# Altium project MultiSpikeHold.PrjPcb
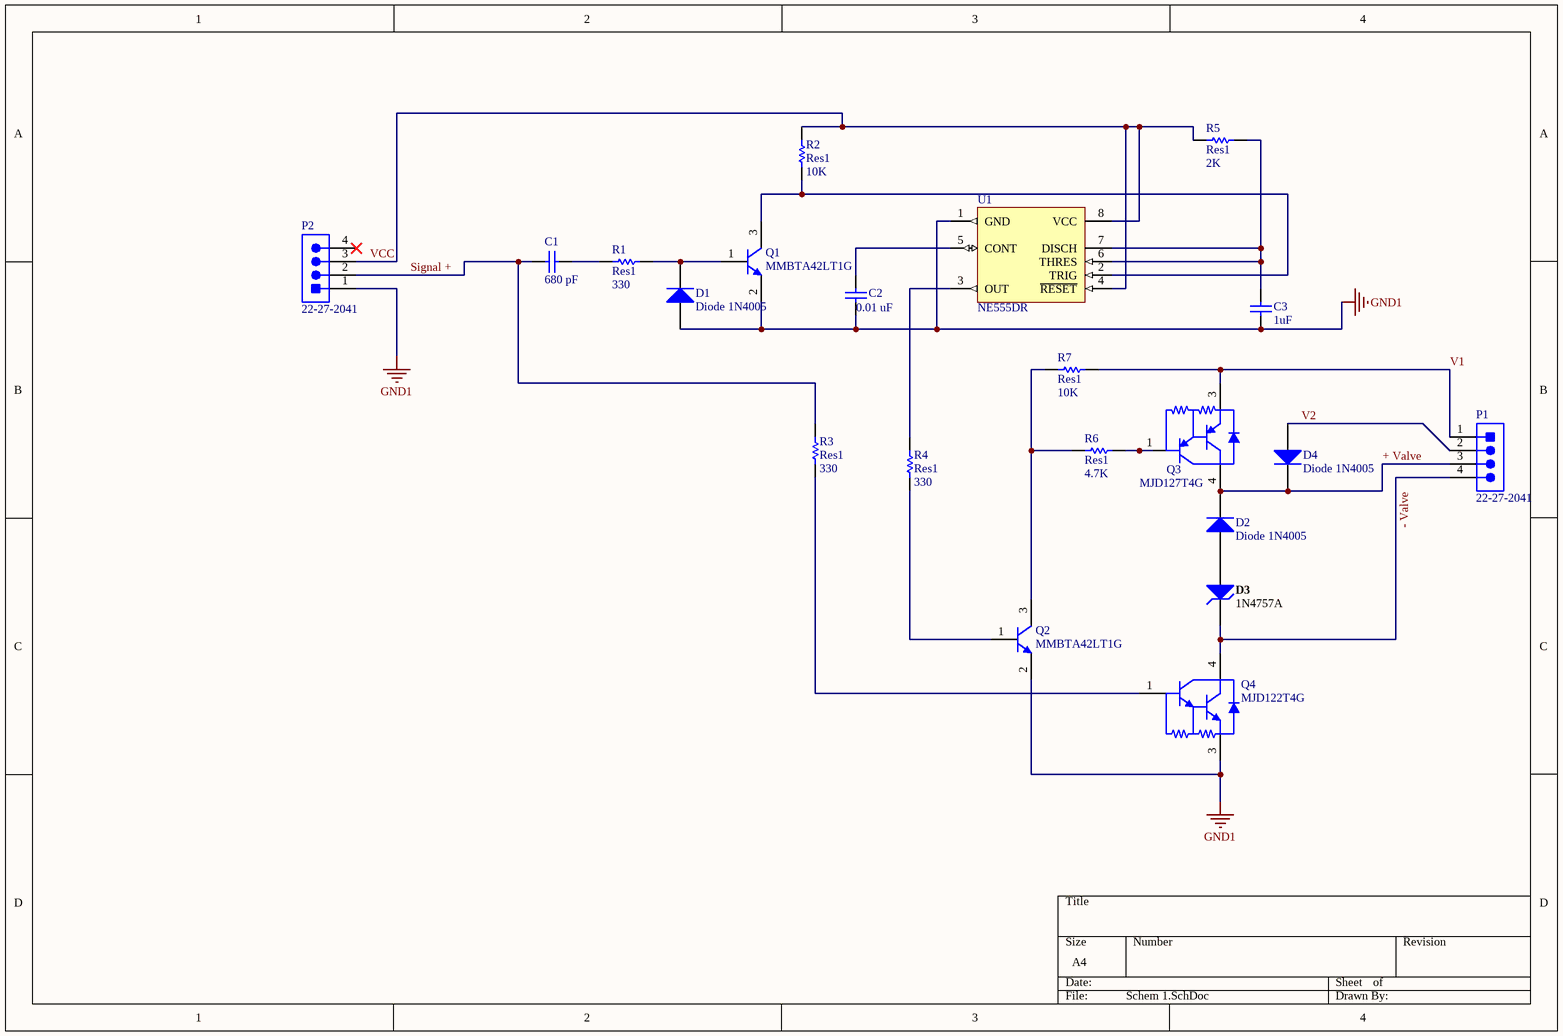
[diagram p0: Schem 1.SchDoc]
2 sheets, 139 parts. Net scope: global (net labels, ports and power ports of the same name join across sheets).
Sheets:
  Schem 1.SchDoc
  MultiSpikeHoldSchem.SchDoc

## Sheet Schem 1.SchDoc
size A4

### Parts
(Parts that share a designator on the sheet are numbered #1, #2 ... from top to bottom, then left to right.)
C1#1  680 pF  [CAPC1005X55X30LL05T10]
C2#1  0.01 uF  [CAPC1608X87X35LL15T15]
C3#1  1uF  [CAPC1206(3216)110_L]
D1#1  Diode 1N4005  [DO-41]
D2#1  Diode 1N4005  [DO-41]
D3#1  1N4757A  [FAIR-DO-41-2_V]
D4#1  Diode 1N4005  [DO-41]
P1#1  22-27-2041  [MOLX-22-27-2041_V]
P2#1  22-27-2041  [MOLX-22-27-2041_V]
Q1#1  MMBTA42LT1G  [ONSC-SOT-23-3-318-08_V]
Q2#1  MMBTA42LT1G  [ONSC-SOT-23-3-318-08_V]
Q3#1  MJD127T4G  [ONSC-DPAK-3-369C-01_V]
Q4#1  MJD122T4G  [ONSC-DPAK-3-369C-01_V]
R1#1  Res1  value 330  [AXIAL-0.3]
R2#1  Res1  value 10K  [AXIAL-0.3]
R3#1  Res1  value 330  [AXIAL-0.3]
R4#1  Res1  value 330  [AXIAL-0.3]
R5#1  Res1  value 2K  [AXIAL-0.3]
R6#1  Res1  value 4.7K  [AXIAL-0.3]
R7#1  Res1  value 10K  [AXIAL-0.3]
U1#1  NE555DR  [D0008A_L]

### Nets
GND1: C2#1.1 C3#1.1 D1#1.1(A) P2#1.1 Q1#1.2(E) Q2#1.2(E) Q4#1.3(E) U1#1.1(GND)
+ Valve: D2#1.2(K) D4#1.2(K) P1#1.3 Q3#1.4(C)
- Valve: D3#1.2(K) P1#1.4 Q4#1.4(C)
Signal +: C1#1.1 P2#1.2 R3#1.2
V1: P1#1.1 Q3#1.3(E) R7#1.2
V2: D4#1.1(A) P1#1.2
VCC: P2#1.3 R2#1.2 R5#1.1 U1#1.4(~{RESET}) U1#1.8(VCC)
NetC1#1_2: C1#1.2 R1#1.1
NetC2#1_2: C2#1.2 U1#1.5(CONT)
NetC3#1_2: C3#1.2 R5#1.2 U1#1.6(THRES) U1#1.7(DISCH)
NetD1#1_2: D1#1.2(K) Q1#1.1(B) R1#1.2
NetD2#1_1: D2#1.1(A) D3#1.1(A)
NetQ1#1_3: Q1#1.3(C) R2#1.1 U1#1.2(TRIG)
NetQ2#1_1: Q2#1.1(B) R4#1.1
NetQ2#1_3: Q2#1.3(C) R6#1.1 R7#1.1
NetQ3#1_1: Q3#1.1(B) R6#1.2
NetQ4#1_1: Q4#1.1(B) R3#1.1
NetR4#1_2: R4#1.2 U1#1.3(OUT)

Not connected (* = marked no-connect by the designer): P2#1 4*

### Library data of the parts
C1#1 = CMP-2008-03245-1: Part Number: C0402C681K5RACTU; Manufacturer: Kemet
C2#1 = CMP-2006-03044-1: Part Number: C0603C103K5RACTU; Manufacturer: Kemet
C3#1 = CMP-1037-04718-1: CAP 1uF 50V ±10% 1206 (3216 Metric) Thickness 1.1mm SMD; Tolerance: Â±10%; Case-EIA: 1206; Case-Metric: 3216; Rated Voltage: 50 V; Max Thickness: 1.1 mm; Value: 1uF; Technology: SMT
D1#1 D2#1 D4#1 = Diode 1N4005: 1 Amp General Purpose Rectifier; Published: 8-Jun-2000; LatestRevisionDate: 17-Jul-2002; LatestRevisionNote: Re-released for DXP Platform.; DatasheetVersion: 1998; PackageVersion: Aug-1999; PackageReference: DO-41; Publisher: Altium Limited; PackageDescription: Diode, Axial; Body 5.2 x 2.7 mm (LxDia. max), Lead Dia. 0.86 mm (max); Code_JEDEC: DO-204-AL; ComponentLink1Description: Manufacturer Link; ComponentLink1URL: http://www.fairchildsemi.com/; ComponentLink2Description: Datasheet; ComponentLink2URL: http://www.fairchildsemi.com/ds/1N%2F1N4001.pdf
D3#1 = CMP-0892-00018-1: Zener Diode, 51V, 1W, 5%, -65 to 200 degC, 2-Pin DO-41, Body 2.72 x 5.2 mm, RoHS; Manufacturer: Fairchild Semiconductor; Test Current IZ (mA): 5; ZZ (Max) (ohm): 95; VZ (Min.) (V): 48.45; VZ (Max.) (V): 53.55; PD (W): 1; Mounting Technology: Through Hole; ComponentLink2Description: Datasheet; ComponentLink1Description: Manufacturer URL; ComponentLink2URL: http://www.fairchildsemi.com/ds/1N/1N4744A.pdf; PackageReference: DO-41-2; PartNumber: 1N4757A; Tolerance: 5%; ComponentLink3URL: http://www.fairchildsemi.com/dwg/DO/DO41A.pdf; IR (uA): 5; PackageDescription: 2-Pin Axial leaded, Body 2.72 x 5.2 mm, Lead Spread 25.4 mm; ComponentLink3Description: Package Specification; RoHS: TRUE; DatasheetVersion: Rev. H3; ComponentLink1URL: http://www.fairchildsemi.com/; PackageVersion: Rev. 2; Operating and Storage Temperature Range: -65 to 200 degC
P1#1 P2#1 = CMP-2000-05243-1: Male Header, Pitch 2.54 mm, 1 x 4 Position, Height 11.7 mm, Tail Length 3.56 mm, RoHS, Bulk; Manufacturer: Molex; Voltage rating: 250V; Current rating: 4A; Datasheet Version: Rev. F, 06/2009; Operating temperature: 0degCto+75degC; Contact material: Tinplatedbrass; Manufacturer URL: http://www.molex.com/; Housing material: Nylon(UL94V-0); Datasheet URL: http://www.molex.com/pdm_docs/sd/022272041_sd.pdf
Q1#1 Q2#1 = CMP-1048-00662-1: High Voltage Transistor, NPN Silicon, 3-Pin SOT-23, Pb-Free, Tape and Reel; Manufacturer: On Semiconductor; fT Min (MHz): 50; IC Continuous (A): 0.5; ComponentLink1URL: http://www.onsemi.com/; ComponentLink3URL: http://www.onsemi.cn/pub_link/Collateral/318-08.PDF; RoHS: TRUE; ComponentLink2Description: Datasheet; PartNumber: MMBTA42LT1G; Polarity: NPN; DatasheetVersion: Rev. 12; PackageReference: SOT-23-3-318-08; PackageDescription: 3-Pin Small Outline Transistor, Body 2.92 x 1.3 mm, Pitch 0.95 mm; ComponentLink3Description: Package Specification; ComponentLink1Description: Manufacturer URL; Packing: Tape and Reel; PackageVersion: Rev. AP, 11/2009; Mounting Technology: Surface Mount; ComponentLink2URL: http://www.onsemi.cn/pub_link/Collateral/MMBTA42LT1-D.PDF
Q3#1 = CMP-1047-00009-1: Complementary Darlington Power Transistor, 3-Pin DPAK, Pb-Free, Tape and Reel; Manufacturer: On Semiconductor; Polarity: PNP; IC Continuous (A): 8; hFE Max (k): 12; ComponentLink3URL: http://www.onsemi.cn/pub_link/Collateral/369C.PDF; PackageReference: DPAK-3-369C-01; RoHS: TRUE; PartNumber: MJD127T4G; ComponentLink2URL: http://www.onsemi.com/pub_link/Collateral/MJD122-D.PDF; PackageDescription: 3-Pin Flange Mount, Body 6.54 x 6.095 mm, Pitch 2.29 mm; Mounting Technology: Surface Mount; Packing: Tape and Reel; DatasheetVersion: Rev. 13; ComponentLink2Description: Datasheet; ComponentLink3Description: Package Specification; ComponentLink1URL: http://www.onsemi.com/; ComponentLink1Description: Manufacturer URL; PackageVersion: Rev. E, 02/2014
Q4#1 = CMP-1047-00007-1: Complementary Darlington Power Transistor, 3-Pin DPAK, Pb-Free, Tape and Reel; Manufacturer: On Semiconductor; IC Continuous (A): 8; hFE Max (k): 12; Polarity: NPN; ComponentLink1Description: Manufacturer URL; ComponentLink3URL: http://www.onsemi.cn/pub_link/Collateral/369C.PDF; Mounting Technology: Surface Mount; RoHS: TRUE; ComponentLink2Description: Datasheet; ComponentLink1URL: http://www.onsemi.com/; ComponentLink3Description: Package Specification; DatasheetVersion: Rev. 13; PackageDescription: 3-Pin Flange Mount, Body 6.54 x 6.095 mm, Pitch 2.29 mm; PartNumber: MJD122T4G; ComponentLink2URL: http://www.onsemi.com/pub_link/Collateral/MJD122-D.PDF; PackageVersion: Rev. E, 02/2014; PackageReference: DPAK-3-369C-01; Packing: Tape and Reel
R1#1 R2#1 R3#1 R4#1 R5#1 R6#1 R7#1 = Res1: Resistor; Published: 8-Jun-2000; LatestRevisionDate: 17-Jul-2002; LatestRevisionNote: Re-released for DXP Platform.; PackageReference: AXIAL-0.3; Publisher: Altium Limited; PackageDescription: Axial Device, Thru-Hole; 2 Leads; 0.3 in Pin Spacing
U1#1 = CMP-1685-00007-1: Precision Timer, 4.5 to 16 V, 0 to 70 degC, 8-Pin SOIC (D8), Green (RoHS & no Sb/Br), Tape and Reel; Forward Voltage: 450 mV; Forward Current: 1 A; Max Surge Current: 30 A; Peak Reverse Current: 500 uA; Case\Package: SMA; PackageReference: D0008A; Width: 2.84 mm; PackageDescription: 8-Pin Small Outline Integrated Circuit, Body 4.9 x 3.9 mm, Pitch 1.27 mm; DatasheetVersion: SLFS022I, 09/2014; ComponentLink2Description: Datasheet; Package Quantity: 1; REACH SVHC: Unknown; Radiation Hardening: No; Height: 2.44 mm; Code_JEDEC: MS-012; Pins: 2; ComponentLink1Description: Manufacturer URL; ComponentLink3Description: Package Specification; ComponentLink3URL: http://www.ti.com/lit/ml/msoi002j/msoi002j.pdf; Length: 4.57 mm; ComponentLink1URL: http://www.ti.com/; Mount: Surface Mount; PackageVersion: 4040047-3/M, 06/2011; ComponentLink2URL: http://www.ti.com/general/docs/lit/getliterature.tsp?genericPartNumber=NE555&fileType=pdf; RoHSCompliant: true; Max Operating Temperature: 125 degC; Packaging: Cut Tape; Min Operating Temperature: -55 degC

## Sheet MultiSpikeHoldSchem.SchDoc
size A1
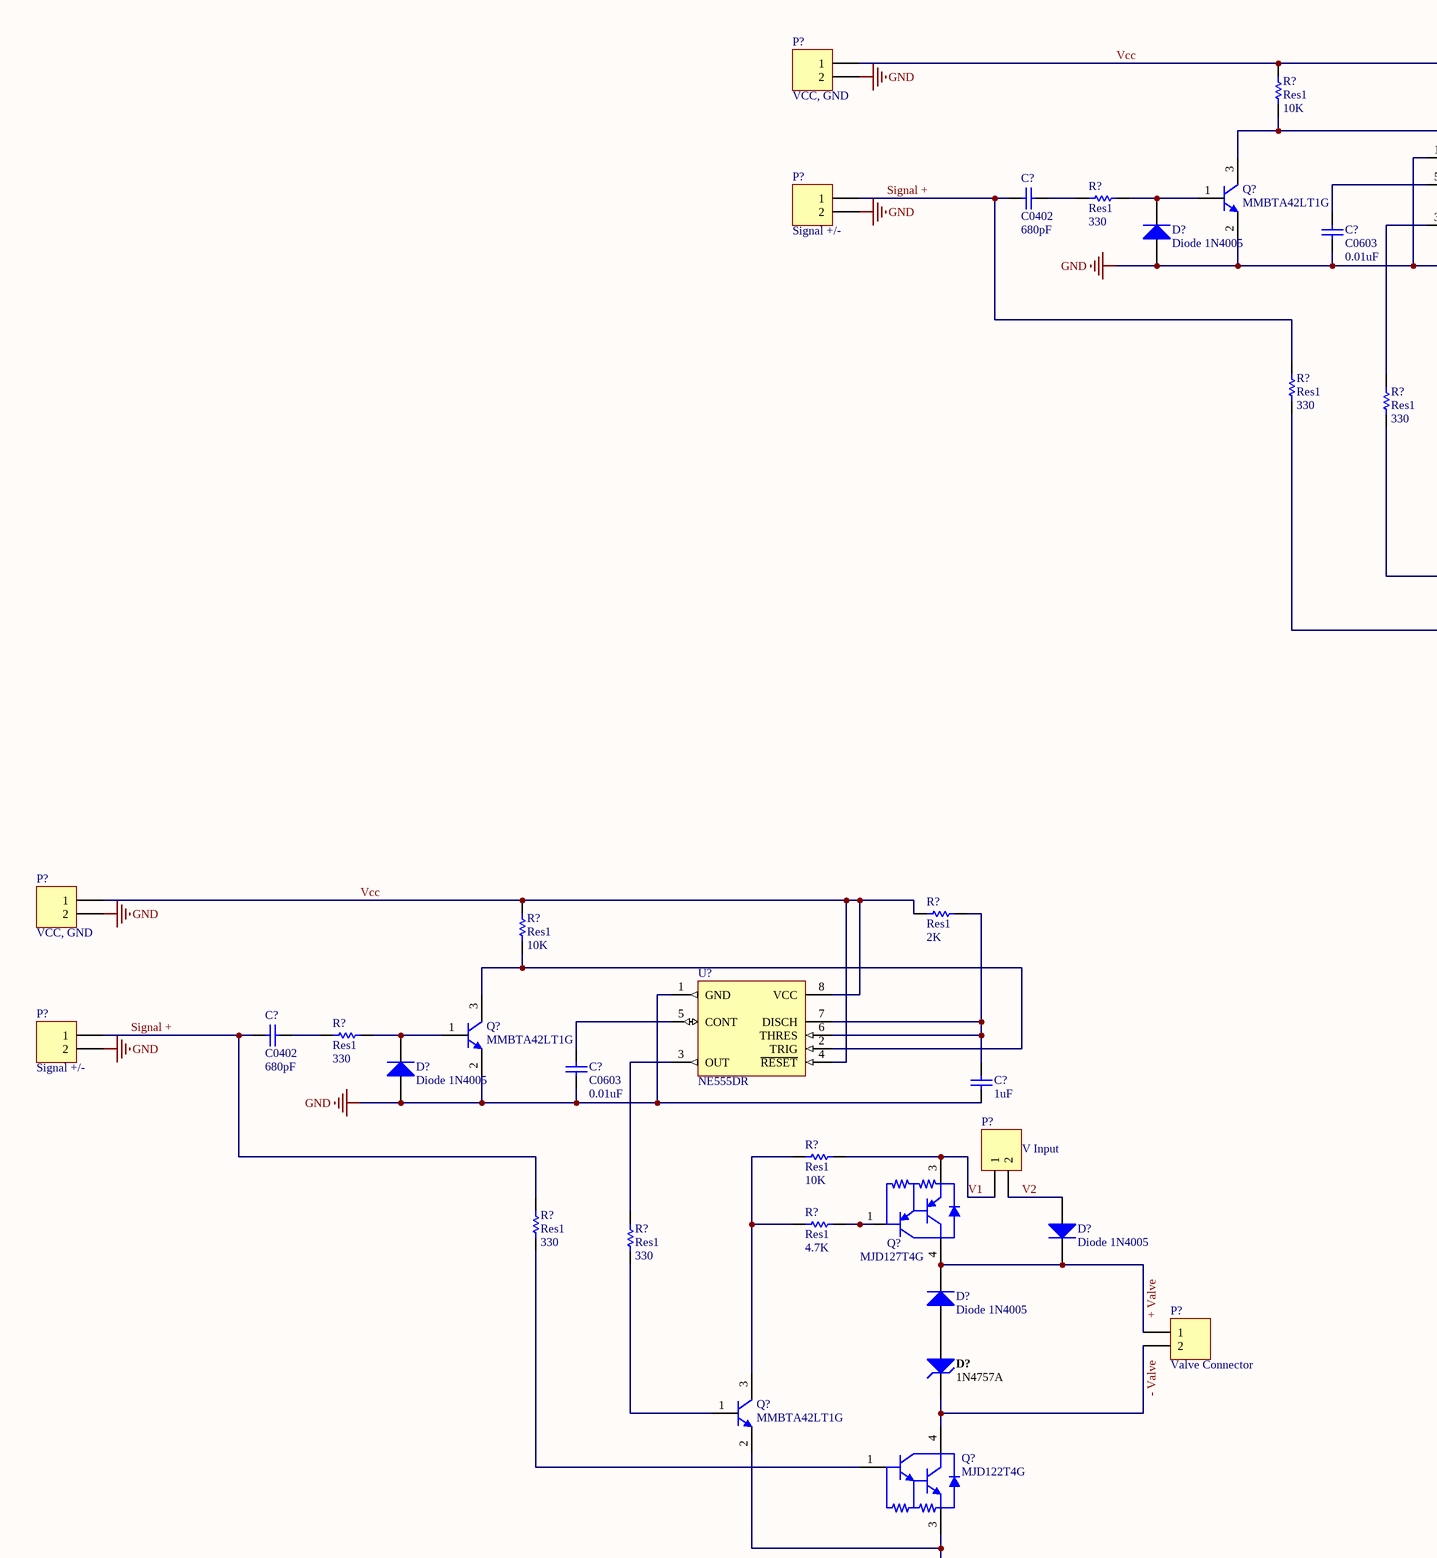
[diagram p1: MultiSpikeHoldSchem.SchDoc, top left]
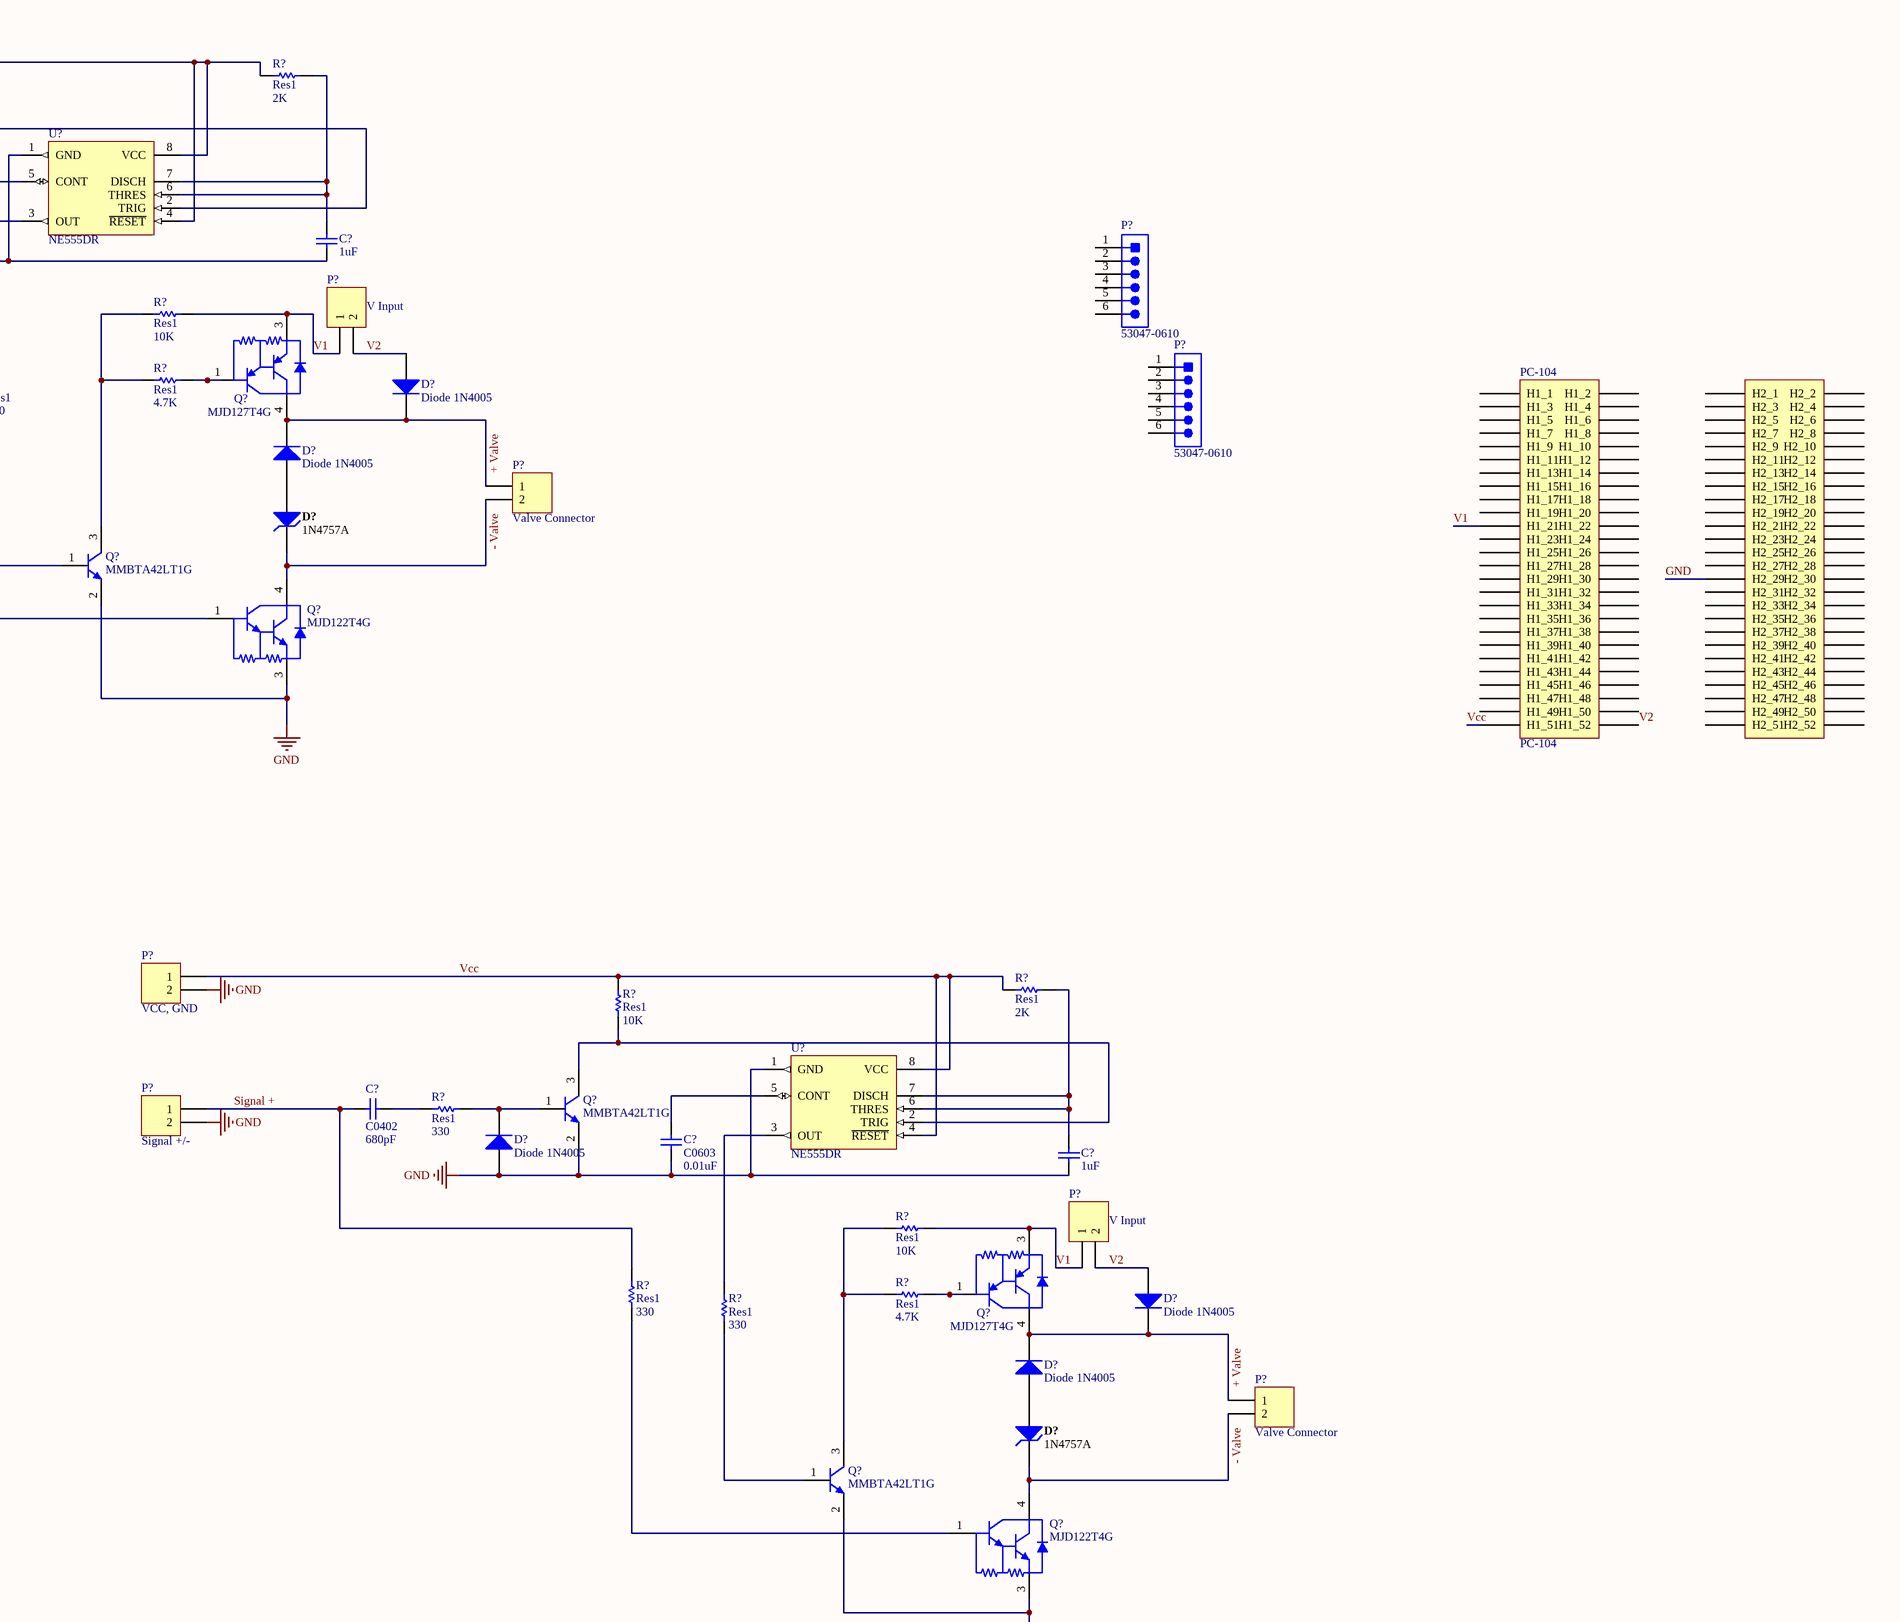
[diagram p2: MultiSpikeHoldSchem.SchDoc, top right]
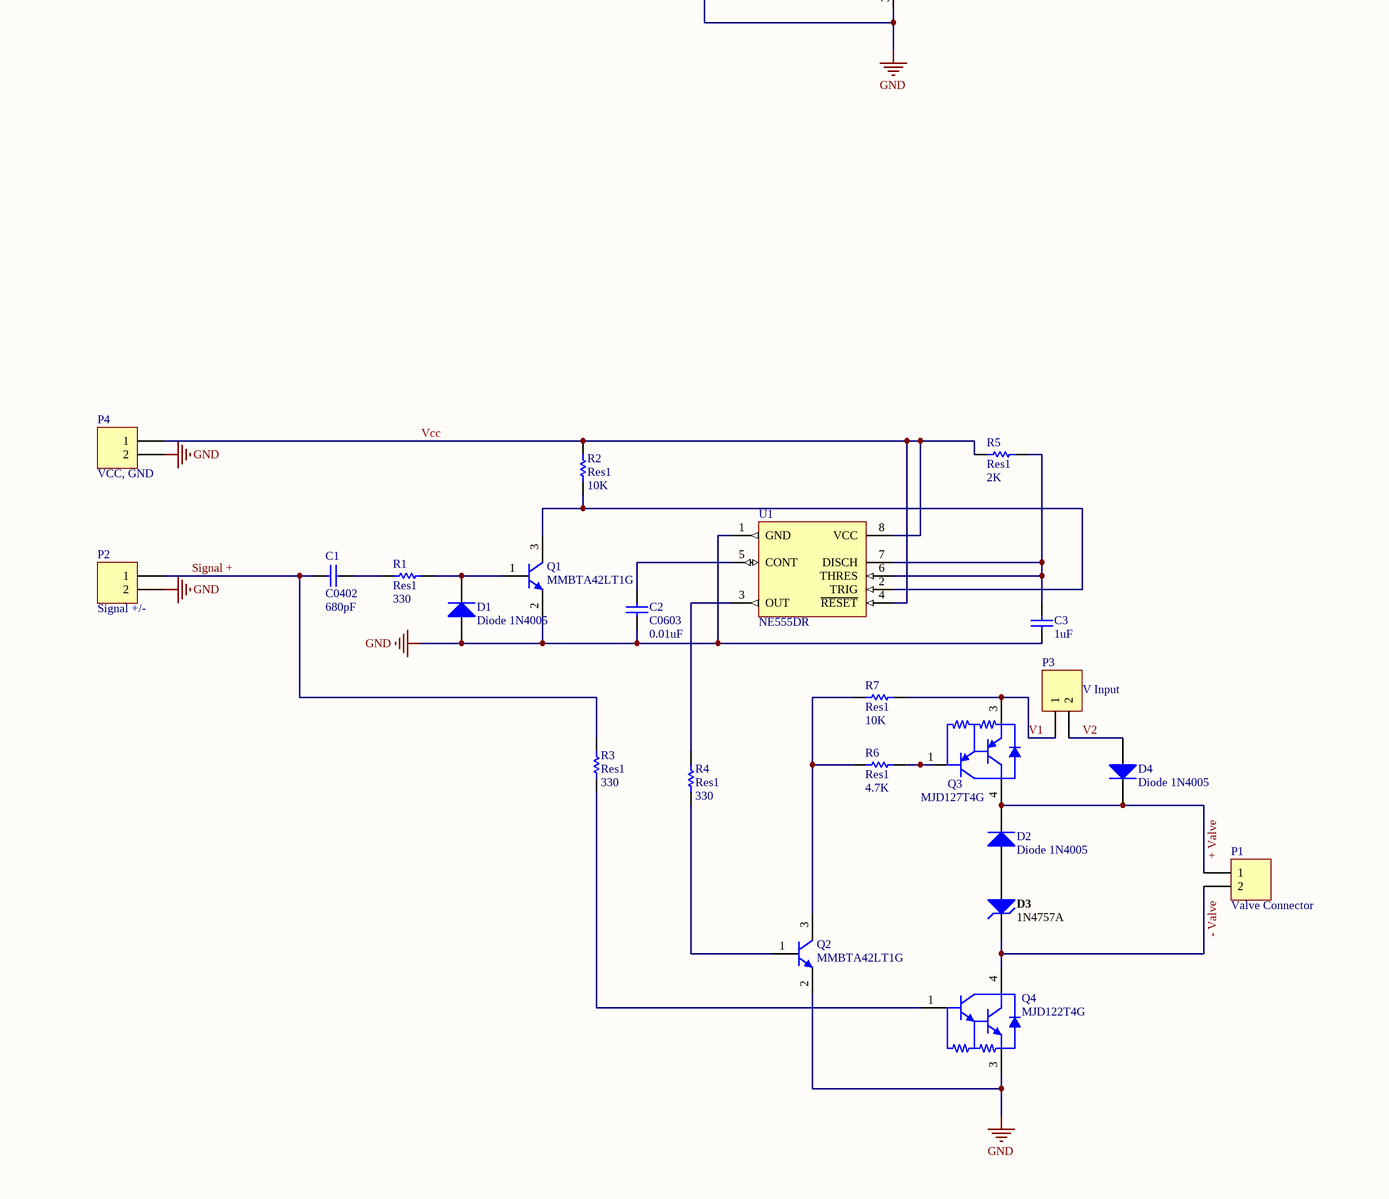
[diagram p3: MultiSpikeHoldSchem.SchDoc, bottom left]
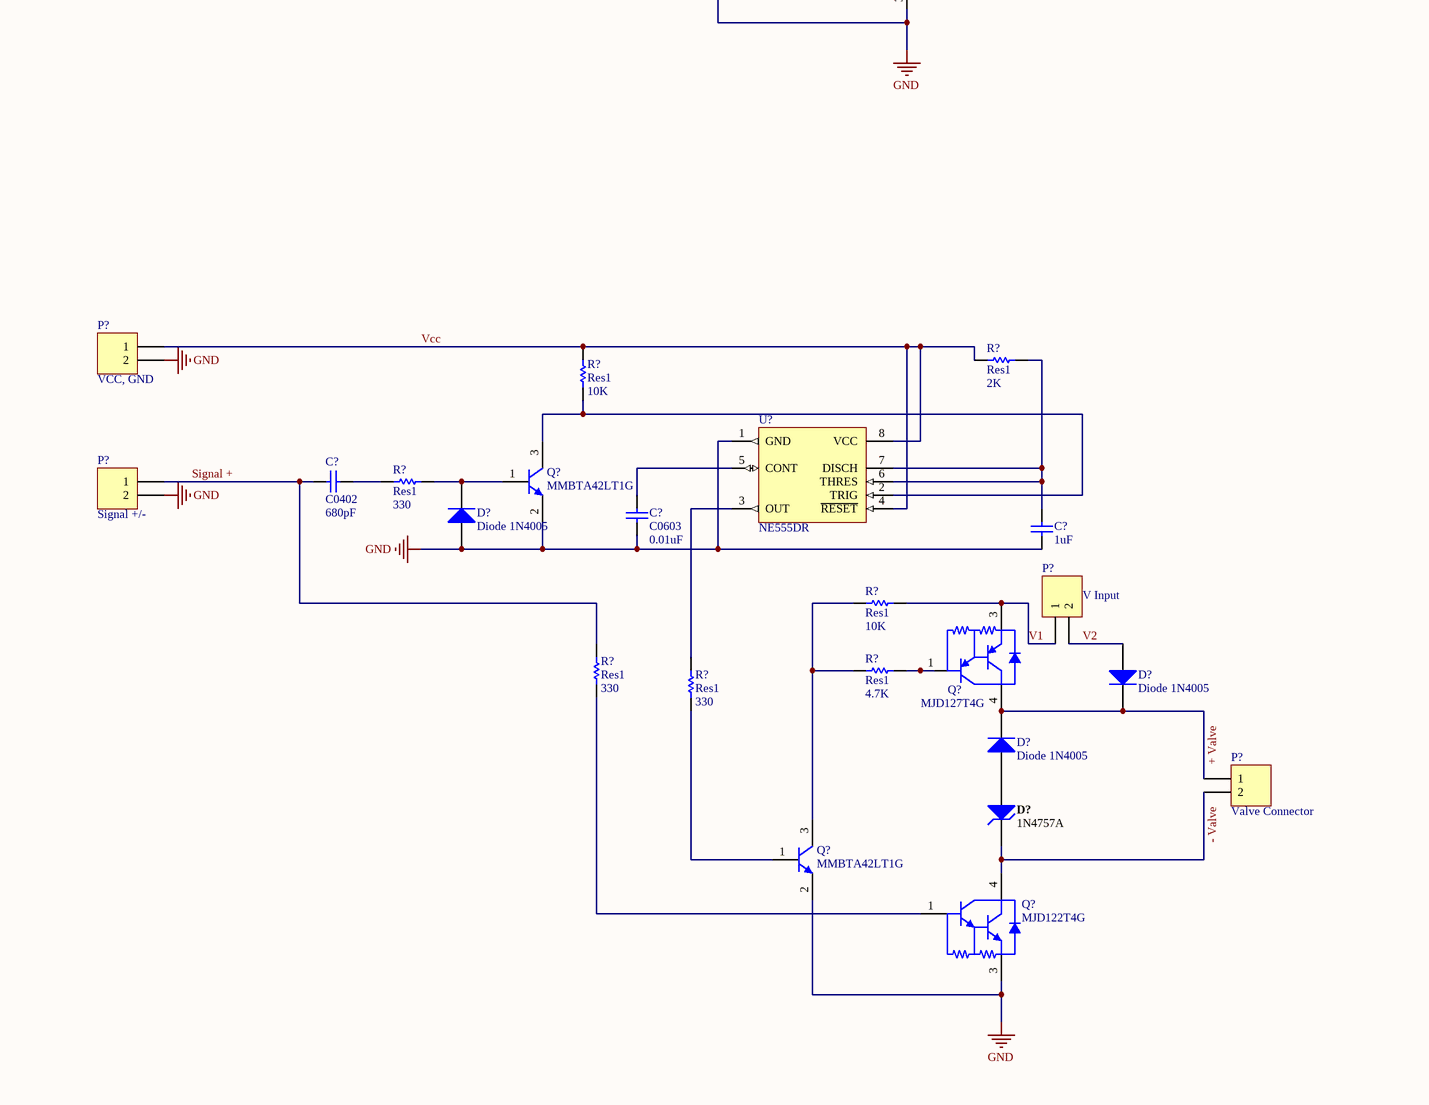
[diagram p4: MultiSpikeHoldSchem.SchDoc, bottom right]

### Parts
(Parts that share a designator on the sheet are numbered #1, #2 ... from top to bottom, then left to right.)
C1#2  C0402  value 680pF  [0402]
C2#2  C0603  value 0.01uF  [0603]
C3#2  1uF  [CAPC1206(3216)110_L]
C?#1  C0402  value 680pF  [0402]
C?#2  C0603  value 0.01uF  [0603]
C?#3  1uF  [CAPC1206(3216)110_L]
C?#4  C0402  value 680pF  [0402]
C?#5  C0603  value 0.01uF  [0603]
C?#6  1uF  [CAPC1206(3216)110_L]
C?#7  C0402  value 680pF  [0402]
C?#8  C0603  value 0.01uF  [0603]
C?#9  1uF  [CAPC1206(3216)110_L]
C?#10  C0402  value 680pF  [0402]
C?#11  C0603  value 0.01uF  [0603]
C?#12  1uF  [CAPC1206(3216)110_L]
D1#2  Diode 1N4005  [DO-41]
D2#2  Diode 1N4005  [DO-41]
D3#2  1N4757A  [FAIR-DO-41-2_V]
D4#2  Diode 1N4005  [DO-41]
D?#1  Diode 1N4005  [DO-41]
D?#2  Diode 1N4005  [DO-41]
D?#3  Diode 1N4005  [DO-41]
D?#4  1N4757A  [FAIR-DO-41-2_V]
D?#5  Diode 1N4005  [DO-41]
D?#6  Diode 1N4005  [DO-41]
D?#7  Diode 1N4005  [DO-41]
D?#8  Diode 1N4005  [DO-41]
D?#9  Diode 1N4005  [DO-41]
D?#10  1N4757A  [FAIR-DO-41-2_V]
D?#11  Diode 1N4005  [DO-41]
D?#12  1N4757A  [FAIR-DO-41-2_V]
D?#13  Diode 1N4005  [DO-41]
D?#14  Diode 1N4005  [DO-41]
D?#15  Diode 1N4005  [DO-41]
D?#16  1N4757A  [FAIR-DO-41-2_V]
P1#2  Valve Connector  [MHDR1X2]
P2#2  Signal +/-  [MHDR1X2]
P3  V Input  [MHDR1X2]
P4  VCC, GND  [MHDR1X2]
P?#1  VCC, GND  [MHDR1X2]
P?#2  Signal +/-  [MHDR1X2]
P?#3  53047-0610  [MOLX-53047-0610_V]
P?#4  V Input  [MHDR1X2]
P?#5  53047-0610  [MOLX-53047-0610_V]
P?#6  Valve Connector  [MHDR1X2]
P?#7  VCC, GND  [MHDR1X2]
P?#8  VCC, GND  [MHDR1X2]
P?#9  Signal +/-  [MHDR1X2]
P?#10  Signal +/-  [MHDR1X2]
P?#11  V Input  [MHDR1X2]
P?#12  V Input  [MHDR1X2]
P?#13  Valve Connector  [MHDR1X2]
P?#14  Valve Connector  [MHDR1X2]
P?#15  VCC, GND  [MHDR1X2]
P?#16  Signal +/-  [MHDR1X2]
P?#17  V Input  [MHDR1X2]
P?#18  Valve Connector  [MHDR1X2]
PC-104  PC-104  [PC-104FOOTPRINT]
Q1#2  MMBTA42LT1G  [ONSC-SOT-23-3-318-08_V]
Q2#2  MMBTA42LT1G  [ONSC-SOT-23-3-318-08_V]
Q3#2  MJD127T4G  [ONSC-DPAK-3-369C-01_V]
Q4#2  MJD122T4G  [ONSC-DPAK-3-369C-01_V]
Q?#1  MMBTA42LT1G  [ONSC-SOT-23-3-318-08_V]
Q?#2  MJD127T4G  [ONSC-DPAK-3-369C-01_V]
Q?#3  MMBTA42LT1G  [ONSC-SOT-23-3-318-08_V]
Q?#4  MJD122T4G  [ONSC-DPAK-3-369C-01_V]
Q?#5  MMBTA42LT1G  [ONSC-SOT-23-3-318-08_V]
Q?#6  MMBTA42LT1G  [ONSC-SOT-23-3-318-08_V]
Q?#7  MJD127T4G  [ONSC-DPAK-3-369C-01_V]
Q?#8  MJD127T4G  [ONSC-DPAK-3-369C-01_V]
Q?#9  MMBTA42LT1G  [ONSC-SOT-23-3-318-08_V]
Q?#10  MJD122T4G  [ONSC-DPAK-3-369C-01_V]
Q?#11  MMBTA42LT1G  [ONSC-SOT-23-3-318-08_V]
Q?#12  MJD122T4G  [ONSC-DPAK-3-369C-01_V]
Q?#13  MMBTA42LT1G  [ONSC-SOT-23-3-318-08_V]
Q?#14  MJD127T4G  [ONSC-DPAK-3-369C-01_V]
Q?#15  MMBTA42LT1G  [ONSC-SOT-23-3-318-08_V]
Q?#16  MJD122T4G  [ONSC-DPAK-3-369C-01_V]
R1#2  Res1  value 330  [AXIAL-0.3]
R2#2  Res1  value 10K  [AXIAL-0.3]
R3#2  Res1  value 330  [AXIAL-0.3]
R4#2  Res1  value 330  [AXIAL-0.3]
R5#2  Res1  value 2K  [AXIAL-0.3]
R6#2  Res1  value 4.7K  [AXIAL-0.3]
R7#2  Res1  value 10K  [AXIAL-0.3]
R?#1  Res1  value 2K  [AXIAL-0.3]
R?#2  Res1  value 10K  [AXIAL-0.3]
R?#3  Res1  value 330  [AXIAL-0.3]
R?#4  Res1  value 10K  [AXIAL-0.3]
R?#5  Res1  value 4.7K  [AXIAL-0.3]
R?#6  Res1  value 330  [AXIAL-0.3]
R?#7  Res1  value 330  [AXIAL-0.3]
R?#8  Res1  value 2K  [AXIAL-0.3]
R?#9  Res1  value 10K  [AXIAL-0.3]
R?#10  Res1  value 2K  [AXIAL-0.3]
R?#11  Res1  value 330  [AXIAL-0.3]
R?#12  Res1  value 10K  [AXIAL-0.3]
R?#13  Res1  value 330  [AXIAL-0.3]
R?#14  Res1  value 10K  [AXIAL-0.3]
R?#15  Res1  value 4.7K  [AXIAL-0.3]
R?#16  Res1  value 330  [AXIAL-0.3]
R?#17  Res1  value 10K  [AXIAL-0.3]
R?#18  Res1  value 330  [AXIAL-0.3]
R?#19  Res1  value 4.7K  [AXIAL-0.3]
R?#20  Res1  value 330  [AXIAL-0.3]
R?#21  Res1  value 330  [AXIAL-0.3]
R?#22  Res1  value 2K  [AXIAL-0.3]
R?#23  Res1  value 10K  [AXIAL-0.3]
R?#24  Res1  value 330  [AXIAL-0.3]
R?#25  Res1  value 10K  [AXIAL-0.3]
R?#26  Res1  value 4.7K  [AXIAL-0.3]
R?#27  Res1  value 330  [AXIAL-0.3]
R?#28  Res1  value 330  [AXIAL-0.3]
U1#2  NE555DR  [D0008A_L]
U?#1  NE555DR  [D0008A_L]
U?#2  NE555DR  [D0008A_L]
U?#3  NE555DR  [D0008A_L]
U?#4  NE555DR  [D0008A_L]

### Nets
GND: C2#2.1 C3#2.1 C?#2.1 C?#3.1 C?#5.1 C?#6.1 C?#8.1 C?#9.1 C?#11.1 C?#12.1 D1#2.1(A) D?#1.1(A) D?#5.1(A) D?#6.1(A) D?#13.1(A) P2#2.2 P4.2 P?#1.2 P?#2.2 P?#7.2 P?#8.2 P?#9.2 P?#10.2 P?#15.2 P?#16.2 PC-104.H2_29 Q1#2.2(E) Q2#2.2(E) Q4#2.3(E) Q?#1.2(E) Q?#3.2(E) Q?#4.3(E) Q?#5.2(E) Q?#6.2(E) Q?#9.2(E) Q?#10.3(E) Q?#11.2(E) Q?#12.3(E) Q?#13.2(E) Q?#15.2(E) Q?#16.3(E) U1#2.1(GND) U?#1.1(GND) U?#2.1(GND) U?#3.1(GND) U?#4.1(GND)
+ Valve: D2#2.2(K) D4#2.2(K) D?#2.2(K) D?#3.2(K) D?#7.2(K) D?#8.2(K) D?#9.2(K) D?#11.2(K) D?#14.2(K) D?#15.2(K) P1#2.1 P?#6.1 P?#13.1 P?#14.1 P?#18.1 Q3#2.4(C) Q?#2.4(C) Q?#7.4(C) Q?#8.4(C) Q?#14.4(C)
- Valve: D3#2.2(K) D?#4.2(K) D?#10.2(K) D?#12.2(K) D?#16.2(K) P1#2.2 P?#6.2 P?#13.2 P?#14.2 P?#18.2 Q4#2.4(C) Q?#4.4(C) Q?#10.4(C) Q?#12.4(C) Q?#16.4(C)
Signal +: C1#2.1 C?#1.1 C?#4.1 C?#7.1 C?#10.1 P2#2.1 P?#2.1 P?#9.1 P?#10.1 P?#16.1 R3#2.2 R?#6.2 R?#16.2 R?#20.2 R?#27.2
V1: P3.1 P?#4.1 P?#11.1 P?#12.1 P?#17.1 PC-104.H1_21 Q3#2.3(E) Q?#2.3(E) Q?#7.3(E) Q?#8.3(E) Q?#14.3(E) R7#2.2 R?#4.2 R?#14.2 R?#17.2 R?#25.2
V2: D4#2.1(A) D?#2.1(A) D?#7.1(A) D?#9.1(A) D?#14.1(A) P3.2 P?#4.2 P?#11.2 P?#12.2 P?#17.2 PC-104.H1_52
VCC: P4.1 P?#1.1 P?#7.1 P?#8.1 P?#15.1 PC-104.H1_51 R2#2.2 R5#2.1 R?#1.1 R?#2.2 R?#8.1 R?#9.2 R?#10.1 R?#12.2 R?#22.1 R?#23.2 U1#2.4(~{RESET}) U1#2.8(VCC) U?#1.4(~{RESET}) U?#1.8(VCC) U?#2.4(~{RESET}) U?#2.8(VCC) U?#3.4(~{RESET}) U?#3.8(VCC) U?#4.4(~{RESET}) U?#4.8(VCC)
NetC1#2_2: C1#2.2 R1#2.1
NetC2#2_2: C2#2.2 U1#2.5(CONT)
NetC3#2_2: C3#2.2 R5#2.2 U1#2.6(THRES) U1#2.7(DISCH)
NetC?#1_2: C?#1.2 R?#3.1
NetC?#2_2: C?#2.2 U?#1.5(CONT)
NetC?#3_2: C?#3.2 R?#1.2 U?#1.6(THRES) U?#1.7(DISCH)
NetC?#4_2: C?#4.2 R?#11.1
NetC?#5_2: C?#5.2 U?#2.5(CONT)
NetC?#6_2: C?#6.2 R?#8.2 U?#2.6(THRES) U?#2.7(DISCH)
NetC?#7_2: C?#7.2 R?#13.1
NetC?#8_2: C?#8.2 U?#3.5(CONT)
NetC?#9_2: C?#9.2 R?#10.2 U?#3.6(THRES) U?#3.7(DISCH)
NetC?#10_2: C?#10.2 R?#24.1
NetC?#11_2: C?#11.2 U?#4.5(CONT)
NetC?#12_2: C?#12.2 R?#22.2 U?#4.6(THRES) U?#4.7(DISCH)
NetD1#2_2: D1#2.2(K) Q1#2.1(B) R1#2.2
NetD2#2_1: D2#2.1(A) D3#2.1(A)
NetD?#1_2: D?#1.2(K) Q?#1.1(B) R?#3.2
NetD?#3_1: D?#3.1(A) D?#4.1(A)
NetD?#5_2: D?#5.2(K) Q?#5.1(B) R?#11.2
NetD?#6_2: D?#6.2(K) Q?#6.1(B) R?#13.2
NetD?#8_1: D?#8.1(A) D?#10.1(A)
NetD?#11_1: D?#11.1(A) D?#12.1(A)
NetD?#13_2: D?#13.2(K) Q?#13.1(B) R?#24.2
NetD?#15_1: D?#15.1(A) D?#16.1(A)
NetQ1#2_3: Q1#2.3(C) R2#2.1 U1#2.2(TRIG)
NetQ2#2_1: Q2#2.1(B) R4#2.1
NetQ2#2_3: Q2#2.3(C) R6#2.1 R7#2.1
NetQ3#2_1: Q3#2.1(B) R6#2.2
NetQ4#2_1: Q4#2.1(B) R3#2.1
NetQ?#1_3: Q?#1.3(C) R?#2.1 U?#1.2(TRIG)
NetQ?#2_1: Q?#2.1(B) R?#5.2
NetQ?#3_1: Q?#3.1(B) R?#7.1
NetQ?#3_3: Q?#3.3(C) R?#4.1 R?#5.1
NetQ?#4_1: Q?#4.1(B) R?#6.1
NetQ?#5_3: Q?#5.3(C) R?#9.1 U?#2.2(TRIG)
NetQ?#6_3: Q?#6.3(C) R?#12.1 U?#3.2(TRIG)
NetQ?#7_1: Q?#7.1(B) R?#15.2
NetQ?#8_1: Q?#8.1(B) R?#19.2
NetQ?#9_1: Q?#9.1(B) R?#18.1
NetQ?#9_3: Q?#9.3(C) R?#14.1 R?#15.1
NetQ?#10_1: Q?#10.1(B) R?#16.1
NetQ?#11_1: Q?#11.1(B) R?#21.1
NetQ?#11_3: Q?#11.3(C) R?#17.1 R?#19.1
NetQ?#12_1: Q?#12.1(B) R?#20.1
NetQ?#13_3: Q?#13.3(C) R?#23.1 U?#4.2(TRIG)
NetQ?#14_1: Q?#14.1(B) R?#26.2
NetQ?#15_1: Q?#15.1(B) R?#28.1
NetQ?#15_3: Q?#15.3(C) R?#25.1 R?#26.1
NetQ?#16_1: Q?#16.1(B) R?#27.1
NetR4#2_2: R4#2.2 U1#2.3(OUT)
NetR?#7_2: R?#7.2 U?#1.3(OUT)
NetR?#18_2: R?#18.2 U?#2.3(OUT)
NetR?#21_2: R?#21.2 U?#3.3(OUT)
NetR?#28_2: R?#28.2 U?#4.3(OUT)

Not connected (* = marked no-connect by the designer): P?#3 1 2 3 4 5 6; P?#5 1 2 3 4 5 6; PC-104 H1_1 H1_2 H1_3 H1_4 H1_5 H1_6 H1_7 H1_8 H1_9 H1_10 H1_11 H1_12 H1_13 H1_14 H1_15 H1_16 H1_17 H1_18 H1_19 H1_20 H1_22 H1_23 H1_24 H1_25 H1_26 H1_27 H1_28 H1_29 H1_30 H1_31 H1_32 H1_33 H1_34 H1_35 H1_36 H1_37 H1_38 H1_39 H1_40 H1_41 H1_42 H1_43 H1_44 H1_45 H1_46 H1_47 H1_48 H1_49 H1_50 H2_1 H2_2 H2_3 H2_4 H2_5 H2_6 H2_7 H2_8 H2_9 H2_10 H2_11 H2_12 H2_13 H2_14 H2_15 H2_16 H2_17 H2_18 H2_19 H2_20 H2_21 H2_22 H2_23 H2_24 H2_25 H2_26 H2_27 H2_28 H2_30 H2_31 H2_32 H2_33 H2_34 H2_35 H2_36 H2_37 H2_38 H2_39 H2_40 H2_41 H2_42 H2_43 H2_44 H2_45 H2_46 H2_47 H2_48 H2_49 H2_50 H2_51 H2_52

### Library data of the parts
C1#2 C?#1 C?#4 C?#7 C?#10 = C0402: Ceramic Chip Capacitor - Standard; Note: Footprint corresponds to dimensions for bulk cassette packaging. This case size has tightened tolerances.; Published: 17-Jul-2002; LatestRevisionDate: 19-Mar-2004; LatestRevisionNote: Silkscreen size reduced.; DatasheetDocument: Mar-2001; PackageDocument: Mar-2001; PackageReference: 0402; Publisher: Altium Limited; Code_JEITA: 0402; Code_IPC: 1005 [0402]; ComponentLink1Description: Manufacturer Link; ComponentLink1URL: http://www.kemet.com/; ComponentLink2Description: Datasheet; ComponentLink2URL: http://www.kemet.com/kemet/web/homepage/kechome.nsf/vapubfilesname/F3102TA.pdf/$file/F3102TA.pdf
C2#2 C?#2 C?#5 C?#8 C?#11 = C0603: Ceramic Chip Capacitor - Standard; Note: Footprint corresponds to dimensions for bulk cassette packaging. This case size has tightened tolerances.; Published: 17-Jul-2002; LatestRevisionDate: 19-Mar-2004; LatestRevisionNote: Silkscreen size reduced.; DatasheetDocument: Mar-2001; PackageDocument: Mar-2001; PackageReference: 0603; Publisher: Altium Limited; Code_JEITA: 0603; Code_IPC: 1608 [0603]; ComponentLink1Description: Manufacturer Link; ComponentLink1URL: http://www.kemet.com/; ComponentLink2Description: Datasheet; ComponentLink2URL: http://www.kemet.com/kemet/web/homepage/kechome.nsf/vapubfilesname/F3102TA.pdf/$file/F3102TA.pdf
C3#2 C?#3 C?#6 C?#9 C?#12 = CMP-1037-04718-1: as C3#1 on sheet Schem 1; Rated Voltage: 50 V; Max Thickness: 1.1 mm; Value: 1uF; Technology: SMT
D1#2 D2#2 D4#2 D?#1-D?#3 D?#5-D?#9 D?#11 D?#13-D?#15 = Diode 1N4005: 1 Amp General Purpose Rectifier; Published: 8-Jun-2000; LatestRevisionDate: 17-Jul-2002; LatestRevisionNote: Re-released for DXP Platform.; DatasheetVersion: 1998; PackageVersion: Aug-1999; PackageReference: DO-41; Publisher: Altium Limited; PackageDescription: Diode, Axial; Body 5.2 x 2.7 mm (LxDia. max), Lead Dia. 0.86 mm (max); Code_JEDEC: DO-204-AL; ComponentLink1Description: Manufacturer Link; ComponentLink1URL: http://www.fairchildsemi.com/; ComponentLink2Description: Datasheet; ComponentLink2URL: http://www.fairchildsemi.com/ds/1N%2F1N4001.pdf
D3#2 D?#4 D?#10 D?#12 D?#16 = CMP-0892-00018-1: as D3#1 on sheet Schem 1; Mounting Technology: Through Hole; ComponentLink2Description: Datasheet; ComponentLink1Description: Manufacturer URL; ComponentLink2URL: http://www.fairchildsemi.com/ds/1N/1N4744A.pdf; PackageReference: DO-41-2; PartNumber: 1N4757A; Tolerance: 5%; ComponentLink3URL: http://www.fairchildsemi.com/dwg/DO/DO41A.pdf; IR (uA): 5; PackageDescription: 2-Pin Axial leaded, Body 2.72 x 5.2 mm, Lead Spread 25.4 mm; ComponentLink3Description: Package Specification; RoHS: TRUE; DatasheetVersion: Rev. H3; ComponentLink1URL: http://www.fairchildsemi.com/; PackageVersion: Rev. 2; Operating and Storage Temperature Range: -65 to 200 degC
P1#2 P2#2 P3 P4 P?#1 P?#2 P?#4 P?#6-P?#18 = MHDR1X2: Header, 2-Pin; LatestRevisionDate: 17-Jul-2002; LatestRevisionNote: Re-released for DXP Platform.; Publisher: Altium Limited
P?#3 P?#5 = CMP-2000-05630-1: Male Header, Pitch 1.25 mm, 1 x 6 Position, Height 4.2 mm, Tail Length 2.3 mm; Manufacturer: Molex; Connector Body Material: –; Body Plating: Tin; External Length / Height: 3.5mm; Withstand Voltage: 250V; Voltage Rating V AC: 125V; No. of Rows: 1; Connector Type: WiretoBoard; Pitch Spacing: 1.25mm; No. of Contacts: 6; Current Rating: 1A; Contact Termination: ThroughHoleVertical; External Depth: 5.5mm; Insulation Resistance: 100Mohm; Gender: Header; Series: PicoBlade; Contact Material: PhosphorBronze; Mounting Technology: ThroughHole; Datasheet Version: Rev. E, 11/1994; Housing Type: GFNylonUL94V-0; MSL: –; SVHC: –; Contact Plating: Tin; Lead Spacing: 1.25mm; Contact Gender: –; Connector Mounting: –; Termination Method: Solder; No. of Poles: 6; Operating Temperature Max: 85°C; Package Description: Male Header, Pitch 1.25 mm, 1 x 6 Position, Height 4.2 mm, Tail Length 2.3 mm; Manufacturer URL: http://www.molex.com/; Working Voltage: 125V; Package Reference: 53047-0610; Operating Temperature Min: -40°C; Datasheet URL: http://www.molex.com/pdm_docs/sd/530470610_sd.pdf; No. of Ways: 6
Q1#2 Q2#2 Q?#1 Q?#3 Q?#5 Q?#6 Q?#9 Q?#11 Q?#13 Q?#15 = CMP-1048-00662-1: as Q1#1 on sheet Schem 1; ComponentLink1URL: http://www.onsemi.com/; ComponentLink3URL: http://www.onsemi.cn/pub_link/Collateral/318-08.PDF; RoHS: TRUE; ComponentLink2Description: Datasheet; PartNumber: MMBTA42LT1G; Polarity: NPN; DatasheetVersion: Rev. 12; PackageReference: SOT-23-3-318-08; PackageDescription: 3-Pin Small Outline Transistor, Body 2.92 x 1.3 mm, Pitch 0.95 mm; ComponentLink3Description: Package Specification; ComponentLink1Description: Manufacturer URL; Packing: Tape and Reel; PackageVersion: Rev. AP, 11/2009; Mounting Technology: Surface Mount; ComponentLink2URL: http://www.onsemi.cn/pub_link/Collateral/MMBTA42LT1-D.PDF
Q3#2 Q?#2 Q?#7 Q?#8 Q?#14 = CMP-1047-00009-1: as Q3#1 on sheet Schem 1; ComponentLink3URL: http://www.onsemi.cn/pub_link/Collateral/369C.PDF; PackageReference: DPAK-3-369C-01; RoHS: TRUE; PartNumber: MJD127T4G; ComponentLink2URL: http://www.onsemi.com/pub_link/Collateral/MJD122-D.PDF; PackageDescription: 3-Pin Flange Mount, Body 6.54 x 6.095 mm, Pitch 2.29 mm; Mounting Technology: Surface Mount; Packing: Tape and Reel; DatasheetVersion: Rev. 13; ComponentLink2Description: Datasheet; ComponentLink3Description: Package Specification; ComponentLink1URL: http://www.onsemi.com/; ComponentLink1Description: Manufacturer URL; PackageVersion: Rev. E, 02/2014
Q4#2 Q?#4 Q?#10 Q?#12 Q?#16 = CMP-1047-00007-1: as Q4#1 on sheet Schem 1; ComponentLink1Description: Manufacturer URL; ComponentLink3URL: http://www.onsemi.cn/pub_link/Collateral/369C.PDF; Mounting Technology: Surface Mount; RoHS: TRUE; ComponentLink2Description: Datasheet; ComponentLink1URL: http://www.onsemi.com/; ComponentLink3Description: Package Specification; DatasheetVersion: Rev. 13; PackageDescription: 3-Pin Flange Mount, Body 6.54 x 6.095 mm, Pitch 2.29 mm; PartNumber: MJD122T4G; ComponentLink2URL: http://www.onsemi.com/pub_link/Collateral/MJD122-D.PDF; PackageVersion: Rev. E, 02/2014; PackageReference: DPAK-3-369C-01; Packing: Tape and Reel
R1#2 R2#2 R3#2 R4#2 R5#2 R6#2 R7#2 R?#1-R?#28 = Res1: Resistor; Published: 8-Jun-2000; LatestRevisionDate: 17-Jul-2002; LatestRevisionNote: Re-released for DXP Platform.; PackageReference: AXIAL-0.3; Publisher: Altium Limited; PackageDescription: Axial Device, Thru-Hole; 2 Leads; 0.3 in Pin Spacing
U1#2 U?#1-U?#4 = CMP-1685-00007-1: as U1#1 on sheet Schem 1; PackageReference: D0008A; Width: 2.84 mm; PackageDescription: 8-Pin Small Outline Integrated Circuit, Body 4.9 x 3.9 mm, Pitch 1.27 mm; DatasheetVersion: SLFS022I, 09/2014; ComponentLink2Description: Datasheet; Package Quantity: 1; REACH SVHC: Unknown; Radiation Hardening: No; Height: 2.44 mm; Code_JEDEC: MS-012; Pins: 2; ComponentLink1Description: Manufacturer URL; ComponentLink3Description: Package Specification; ComponentLink3URL: http://www.ti.com/lit/ml/msoi002j/msoi002j.pdf; Length: 4.57 mm; ComponentLink1URL: http://www.ti.com/; Mount: Surface Mount; PackageVersion: 4040047-3/M, 06/2011; ComponentLink2URL: http://www.ti.com/general/docs/lit/getliterature.tsp?genericPartNumber=NE555&fileType=pdf; RoHSCompliant: true; Max Operating Temperature: 125 degC; Packaging: Cut Tape; Min Operating Temperature: -55 degC

## Nets that join several sheets
+ Valve: Schem 1 (D2#1.2 D4#1.2 P1#1.3 Q3#1.4), MultiSpikeHoldSchem (20 pins)
- Valve: Schem 1 (D3#1.2 P1#1.4 Q4#1.4), MultiSpikeHoldSchem (15 pins)
Signal +: Schem 1 (C1#1.1 P2#1.2 R3#1.2), MultiSpikeHoldSchem (15 pins)
V1: Schem 1 (P1#1.1 Q3#1.3 R7#1.2), MultiSpikeHoldSchem (16 pins)
V2: Schem 1 (D4#1.1 P1#1.2), MultiSpikeHoldSchem (11 pins)
VCC: Schem 1 (5 pins), MultiSpikeHoldSchem (26 pins)